# Altium schematic sheet camera.SchDoc: CAMERA
size 431 x 279 mm; SheetNumber: 2; SheetTotal: 4; SheetRevision: 1.0
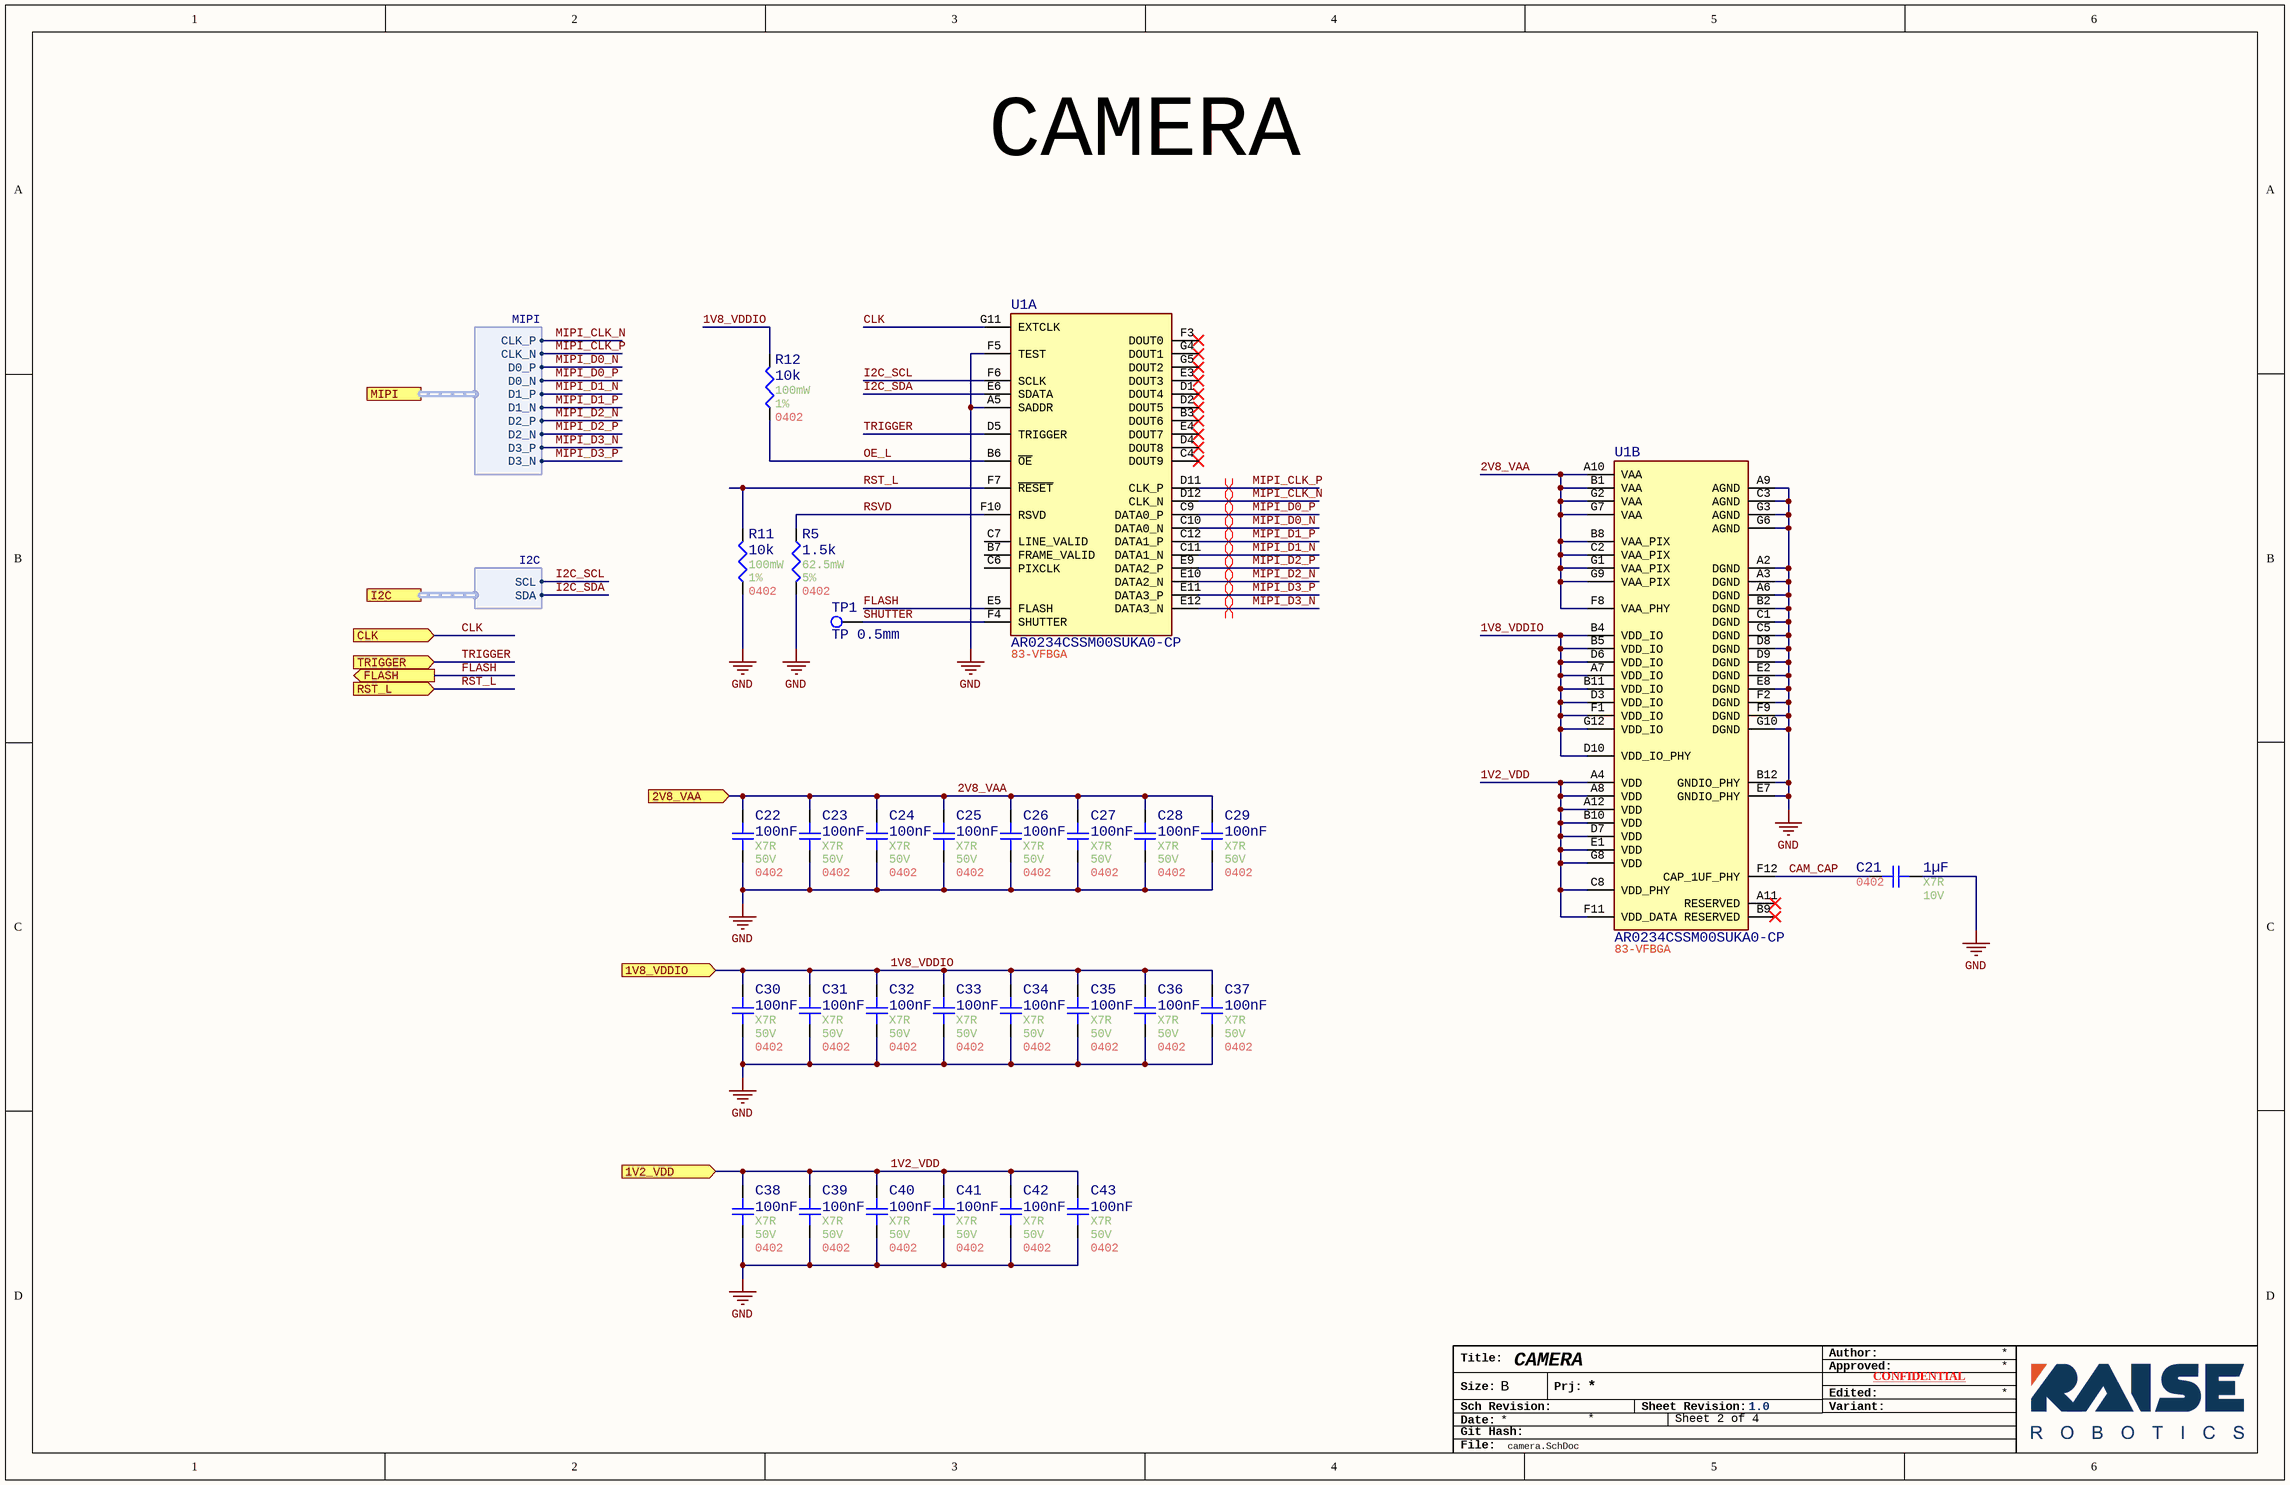
[diagram p0: camera.SchDoc]

## Parts
C21  value 1µF  Temperature Coefficient: X7R  Voltage Rating: 10V  Case/Package: 0402  [Generic 0402 capacitor]  (hidden comment: MAASL105CD7105MFCA01)
C22  value 100nF  Temperature Coefficient: X7R  Voltage Rating: 50V  Case/Package: 0402  [Generic 0402 capacitor]  (hidden comment: GRT155R71H104KE01D)
C23  value 100nF  Temperature Coefficient: X7R  Voltage Rating: 50V  Case/Package: 0402  [Generic 0402 capacitor]  (hidden comment: GRT155R71H104KE01D)
C24  value 100nF  Temperature Coefficient: X7R  Voltage Rating: 50V  Case/Package: 0402  [Generic 0402 capacitor]  (hidden comment: GRT155R71H104KE01D)
C25  value 100nF  Temperature Coefficient: X7R  Voltage Rating: 50V  Case/Package: 0402  [Generic 0402 capacitor]  (hidden comment: GRT155R71H104KE01D)
C26  value 100nF  Temperature Coefficient: X7R  Voltage Rating: 50V  Case/Package: 0402  [Generic 0402 capacitor]  (hidden comment: GRT155R71H104KE01D)
C27  value 100nF  Temperature Coefficient: X7R  Voltage Rating: 50V  Case/Package: 0402  [Generic 0402 capacitor]  (hidden comment: GRT155R71H104KE01D)
C28  value 100nF  Temperature Coefficient: X7R  Voltage Rating: 50V  Case/Package: 0402  [Generic 0402 capacitor]  (hidden comment: GRT155R71H104KE01D)
C29  value 100nF  Temperature Coefficient: X7R  Voltage Rating: 50V  Case/Package: 0402  [Generic 0402 capacitor]  (hidden comment: GRT155R71H104KE01D)
C30  value 100nF  Temperature Coefficient: X7R  Voltage Rating: 50V  Case/Package: 0402  [Generic 0402 capacitor]  (hidden comment: GRT155R71H104KE01D)
C31  value 100nF  Temperature Coefficient: X7R  Voltage Rating: 50V  Case/Package: 0402  [Generic 0402 capacitor]  (hidden comment: GRT155R71H104KE01D)
C32  value 100nF  Temperature Coefficient: X7R  Voltage Rating: 50V  Case/Package: 0402  [Generic 0402 capacitor]  (hidden comment: GRT155R71H104KE01D)
C33  value 100nF  Temperature Coefficient: X7R  Voltage Rating: 50V  Case/Package: 0402  [Generic 0402 capacitor]  (hidden comment: GRT155R71H104KE01D)
C34  value 100nF  Temperature Coefficient: X7R  Voltage Rating: 50V  Case/Package: 0402  [Generic 0402 capacitor]  (hidden comment: GRT155R71H104KE01D)
C35  value 100nF  Temperature Coefficient: X7R  Voltage Rating: 50V  Case/Package: 0402  [Generic 0402 capacitor]  (hidden comment: GRT155R71H104KE01D)
C36  value 100nF  Temperature Coefficient: X7R  Voltage Rating: 50V  Case/Package: 0402  [Generic 0402 capacitor]  (hidden comment: GRT155R71H104KE01D)
C37  value 100nF  Temperature Coefficient: X7R  Voltage Rating: 50V  Case/Package: 0402  [Generic 0402 capacitor]  (hidden comment: GRT155R71H104KE01D)
C38  value 100nF  Temperature Coefficient: X7R  Voltage Rating: 50V  Case/Package: 0402  [Generic 0402 capacitor]  (hidden comment: GRT155R71H104KE01D)
C39  value 100nF  Temperature Coefficient: X7R  Voltage Rating: 50V  Case/Package: 0402  [Generic 0402 capacitor]  (hidden comment: GRT155R71H104KE01D)
C40  value 100nF  Temperature Coefficient: X7R  Voltage Rating: 50V  Case/Package: 0402  [Generic 0402 capacitor]  (hidden comment: GRT155R71H104KE01D)
C41  value 100nF  Temperature Coefficient: X7R  Voltage Rating: 50V  Case/Package: 0402  [Generic 0402 capacitor]  (hidden comment: GRT155R71H104KE01D)
C42  value 100nF  Temperature Coefficient: X7R  Voltage Rating: 50V  Case/Package: 0402  [Generic 0402 capacitor]  (hidden comment: GRT155R71H104KE01D)
C43  value 100nF  Temperature Coefficient: X7R  Voltage Rating: 50V  Case/Package: 0402  [Generic 0402 capacitor]  (hidden comment: GRT155R71H104KE01D)
R5  value 1.5k  Power: 62.5mW  Tolerance: 5%  Case/Package: 0402  [Generic 0402 Resistor]  (hidden comment: RMCF0402JT1K50)
R11  value 10k  Power: 100mW  Tolerance: 1%  Case/Package: 0402  [Generic 0402 Resistor]  (hidden comment: RNCP0402FTD10K0)
R12  value 10k  Power: 100mW  Tolerance: 1%  Case/Package: 0402  [Generic 0402 Resistor]  (hidden comment: RNCP0402FTD10K0)
TP1  TP 0.5mm  [TP 0.5mm]  (no BOM)
U1  AR0234CSSM00SUKA0-CP  [83-VFBGA]  (parts A,B of 2)

## Ports
1V2_VDD (in), 1V8_VDDIO (in), 2V8_VAA (in), CLK (in), FLASH (out), I2C (harness I2C), MIPI (harness MIPI), RST_L (in), TRIGGER (in)

## Harnesses
MIPI: CLK_P, CLK_N, D0_P, D0_N, D1_P, D1_N, D2_P, D2_N, D3_P, D3_N
I2C: SCL, SDA

## Nets
GND: C21.1 C22.1 C23.1 C24.1 C25.1 C26.1 C27.1 C28.1 C29.1 C30.1 C31.1 C32.1 C33.1 C34.1 C35.1 C36.1 C37.1 C38.1 C39.1 C40.1 C41.1 C42.1 C43.1 R5.2 R11.1 U1.A2(DGND) U1.A3(DGND) U1.A5(SADDR) U1.A6(DGND) U1.A9(AGND) U1.B2(DGND) U1.B12(GNDIO_PHY) U1.C1(DGND) U1.C3(AGND) U1.C5(DGND) U1.D8(DGND) U1.D9(DGND) U1.E2(DGND) U1.E7(GNDIO_PHY) U1.E8(DGND) U1.F2(DGND) U1.F5(TEST) U1.F9(DGND) U1.G3(AGND) U1.G6(AGND) U1.G10(DGND)
1V2_VDD: C38.2 C39.2 C40.2 C41.2 C42.2 C43.2 U1.A4(VDD) U1.A8(VDD) U1.A12(VDD) U1.B10(VDD) U1.C8(VDD_PHY) U1.D7(VDD) U1.E1(VDD) U1.F11(VDD_DATA) U1.G8(VDD) ; port 1V2_VDD
1V8_VDDIO: C30.2 C31.2 C32.2 C33.2 C34.2 C35.2 C36.2 C37.2 R12.2 U1.A7(VDD_IO) U1.B4(VDD_IO) U1.B5(VDD_IO) U1.B11(VDD_IO) U1.D3(VDD_IO) U1.D6(VDD_IO) U1.D10(VDD_IO_PHY) U1.F1(VDD_IO) U1.G12(VDD_IO) ; port 1V8_VDDIO
2V8_VAA: C22.2 C23.2 C24.2 C25.2 C26.2 C27.2 C28.2 C29.2 U1.A10(VAA) U1.B1(VAA) U1.B8(VAA_PIX) U1.C2(VAA_PIX) U1.F8(VAA_PHY) U1.G1(VAA_PIX) U1.G2(VAA) U1.G7(VAA) U1.G9(VAA_PIX) ; port 2V8_VAA
CAM_CAP: C21.2 U1.F12(CAP_1UF_PHY)
CLK: U1.G11(EXTCLK) ; port CLK
FLASH: U1.E5(FLASH) ; port FLASH
I2C_SCL: U1.F6(SCLK) ; port I2C.SCL
I2C_SDA: U1.E6(SDATA) ; port I2C.SDA
MIPI_CLK_N: U1.D12(CLK_N) ; port MIPI.CLK_P
MIPI_CLK_P: U1.D11(CLK_P) ; port MIPI.CLK_N
MIPI_D0_N: U1.C10(DATA0_N) ; port MIPI.D0_P
MIPI_D0_P: U1.C9(DATA0_P) ; port MIPI.D0_N
MIPI_D1_N: U1.C11(DATA1_N) ; port MIPI.D1_P
MIPI_D1_P: U1.C12(DATA1_P) ; port MIPI.D1_N
MIPI_D2_N: U1.E10(DATA2_N) ; port MIPI.D2_P
MIPI_D2_P: U1.E9(DATA2_P) ; port MIPI.D2_N
MIPI_D3_N: U1.E12(DATA3_N) ; port MIPI.D3_P
MIPI_D3_P: U1.E11(DATA3_P) ; port MIPI.D3_N
OE_L: R12.1 U1.B6(~{OE})
RST_L: R11.2 U1.F7(~{RESET}) ; port RST_L
RSVD: R5.1 U1.F10(RSVD)
SHUTTER: TP1.1 U1.F4(SHUTTER)
TRIGGER: U1.D5(TRIGGER) ; port TRIGGER

Not connected (* = marked no-connect by the designer): U1 A11(RESERVED)* B3(DOUT6)* B7(FRAME_VALID) B9(RESERVED)* C4(DOUT9)* C6(PIXCLK) C7(LINE_VALID) D1(DOUT4)* D2(DOUT5)* D4(DOUT8)* E3(DOUT3)* E4(DOUT7)* F3(DOUT0)* G4(DOUT1)* G5(DOUT2)*

## Layout directives
differential pair: MIPI_CLK_N, MIPI_CLK_P, MIPI_D0_N, MIPI_D0_P, MIPI_D1_N, MIPI_D1_P, MIPI_D2_N, MIPI_D2_P, MIPI_D3_N, MIPI_D3_P

## Notes on the sheet
- CAMERA
- Title:
- Author:
- Approved:
- Size:
- Date:
- Git Hash:
- Sch Revision:
- B
- Prj:
- Sheet Revision:
- Variant:
- Edited:
- CONFIDENTIAL
- File:

## Library data of the parts
C21 = CMP-001-00104-2: Cap Cer 1UF 20V X7T 0402; AECQ: Yes; Capacitor Type: Ceramic; Tolerance: 20%; Min Operating Temperature: -55°C; Max Operating Temperature: 125°C; Pins: 2; RoHS Compliant: Yes; Mounting Technology: Surface Mount
C22-C43 = CMP-001-00084-12: Ceramic Capacitor, Multilayer, Ceramic, 50V, 10% +Tol, 10% -Tol, X7R, 15% TC, 0.1uF, Surface Mount, 0402; Multilayer: Yes; Terminal Finish: Nickel; Capacitor Type: Ceramic; Package Shape: Rectangular; Reach SVHC Compliant: Yes; Max Operating Temperature: 125°C; RoHS Compliant: Yes; Termination: Wraparound; Packaging: Tape and Reel; AECQ: Yes; Pins: 2; Dielectric Material: Ceramic; Min Operating Temperature: -55°C; Tolerance: 10%; Mounting Technology: Surface Mount
R5 = CMP-009-00226-1: Res Thick Film 0402 1.5K Ohm 5% 0.063W ±100ppm/°C Molded SMD Paper T/R; AECQ: Yes; Pins: 2; Mounting Technology: Surface Mount; RoHS Compliant: Yes; Max Operating Temperature: 155°C; Min Operating Temperature: -55°C
R11 R12 = CMP-009-00242-1: Fixed Resistor, Thin Film, 0.1W, 10000ohm, 50V, 1% +/-Tol, 100ppm/Cel, Surface Mount, 0402; Manufacturer Part Number: Blank; AECQ: Yes; Pins: 2; Max Operating Temperature: 155°C; Voltage Rating: 50V; Mounting Technology: SMD; Min Operating Temperature: -55°C
TP1 = CMP-00010-1: 0.5mm circular test point; Size: 0.5mm
U1 = CMP-031-00017-2: 1/2.6-inch 2.3 Mp CMOS Digital Image Sensor with Global Shutter 2.3MP 1/2.6, Mono, 0 deg CRA; MPN: TJA1051TK/3/1J; Max Supply Voltage: 1.26V; AECQ: Yes; Min Supply Voltage: 1.14V; Case/Package: 83-VFBGA; Pins: 8; Min Operating Temperature: -40°C; Mounting Technology: Surface Mount; Max Operating Temperature: 85°C